# EAGLE design open_cw_keyer_mk2_v30 (EAGLE 9.2.2)
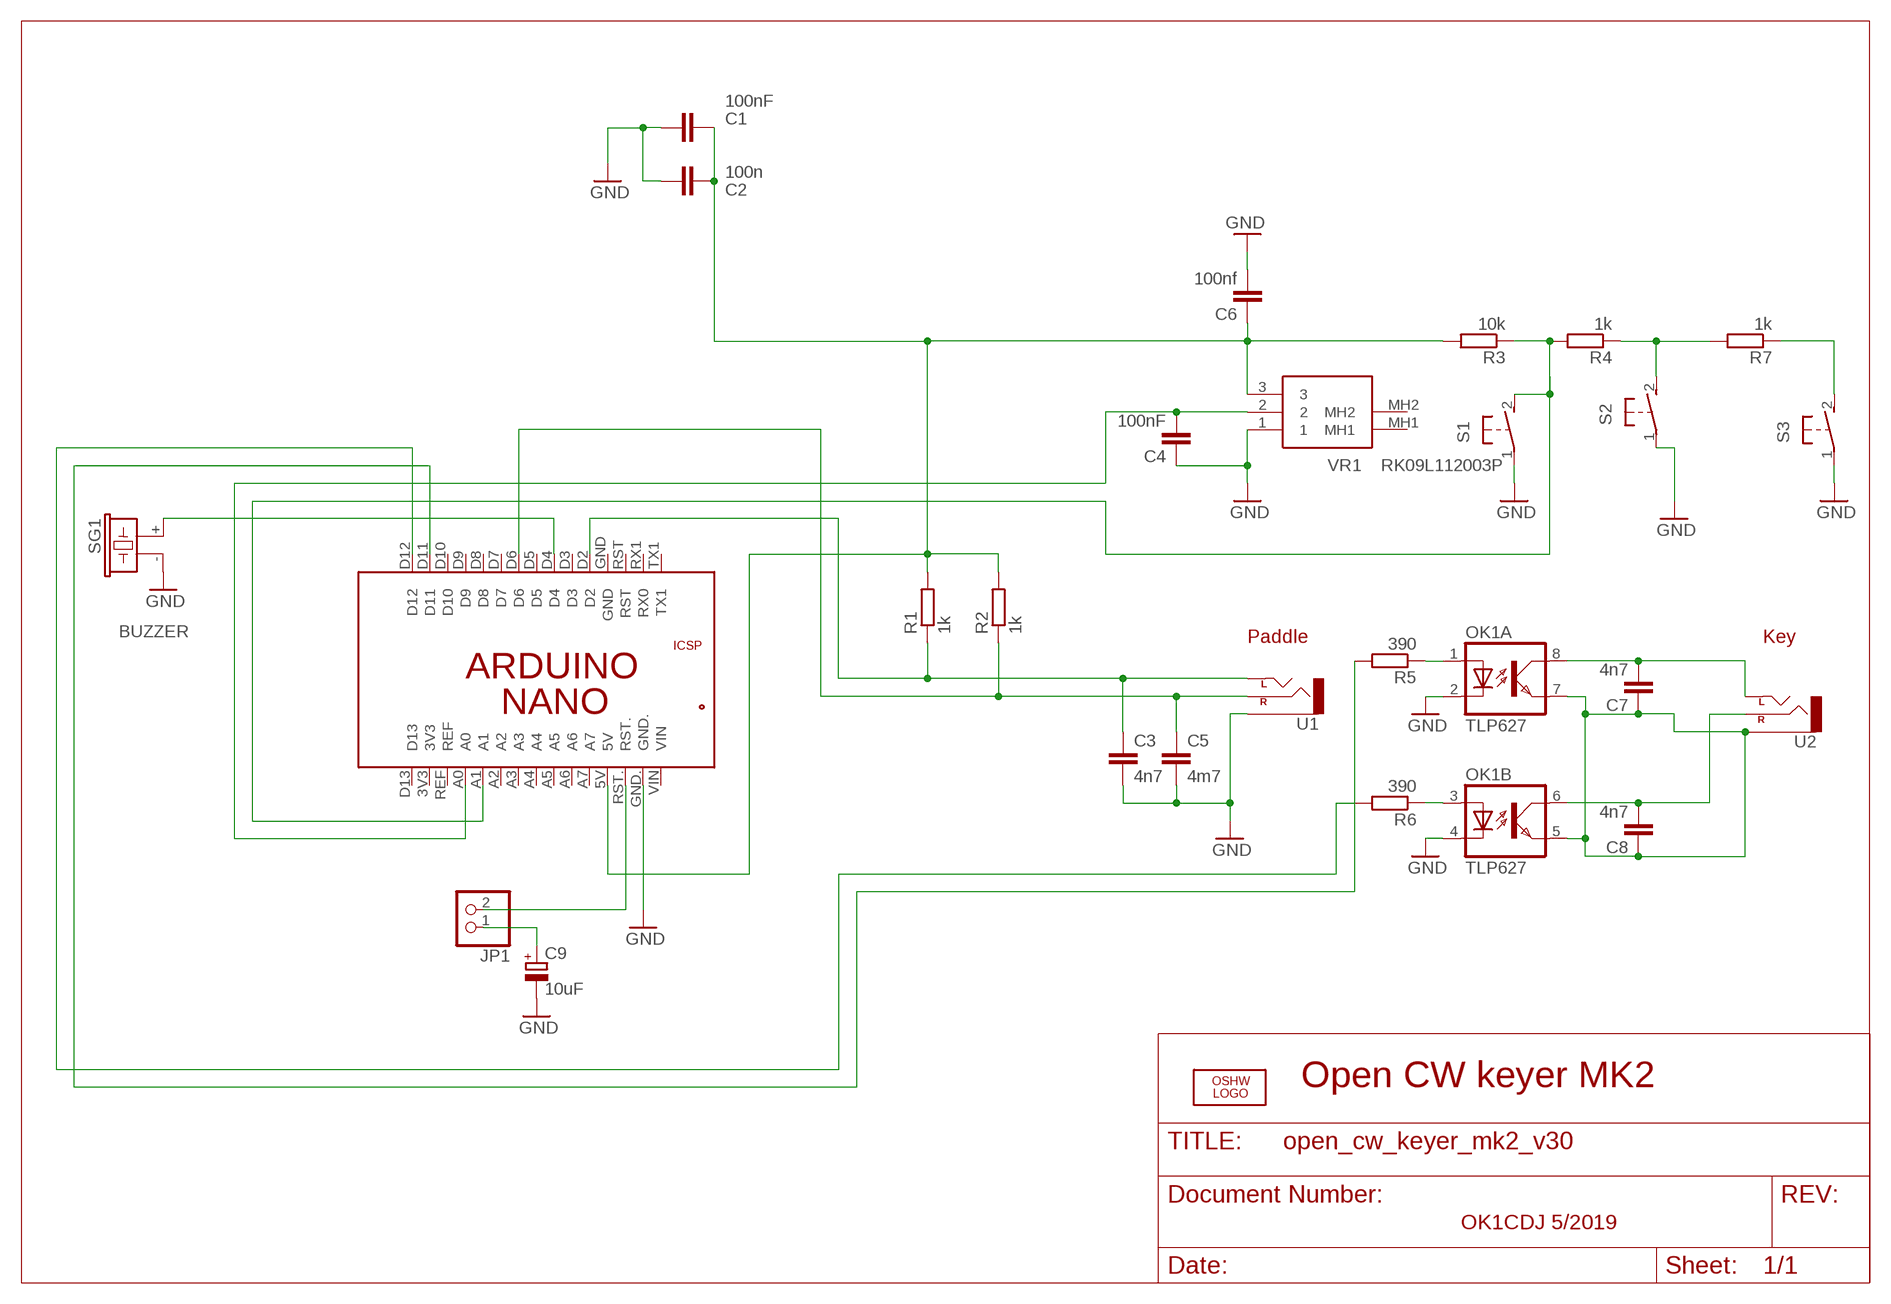
[diagram p0: schematic, sheet 1]

## Parts
C1  100nF  C-EUC0805  [C0805]
C2  100n  C-EUC0805  [C0805]
C3  4n7  C-EUC0805  [C0805]
C4  100nF  C-EUC0805  [C0805]
C5  4m7  C-EUC0805  [C0805]
C6  100nf  C-EUC0805  [C0805]
C7  4n7  C-EUC0805K  [C0805K]
C8  4n7  C-EUC0805K  [C0805K]
C9  10uF  CPOL-EUB/3528-21R  [B/3528-21R]
JP1  PINHD-1X2/90  [1X02/90]
LOGO1  OSHW_LOGO_FILLX0150-NT  [OSHW_FILLX150_NOTEXT]
OK1  TLP627  ILD621  [DIL08]
PCB1  ARDUINO_NANO  [ARDUINO_NANO]
R1  1k  R-EU_M0805  [M0805]
R2  1k  R-EU_M0805  [M0805]
R3  10k  R-EU_M0805  [M0805]
R4  1k  R-EU_M0805  [M0805]
R5  390  R-EU_M0805  [M0805]
R6  390  R-EU_M0805  [M0805]
R7  1k  R-EU_M0805  [M0805]
S1  31-XX  [B3F-31XX]
S2  31-XX  [B3F-31XX]
S3  31-XX  [B3F-31XX]
SG1  BUZZER  F/CM12P  [F/CM12P]
U1  AUDIO-JACKPTH  [AUDIO-JACK]
U2  AUDIO-JACKPTH  [AUDIO-JACK]
VR1  RK09L112003P  [RK09L112003P]

## Nets
5V: C1.1 C2.1 C6.1 PCB1.5V R1.2 R2.2 R3.2 VR1.3
GND: C1.2 C2.2 C3.2 C4.1 C5.2 C6.2 C9.- OK1.2(A:C) OK1.4(B:C) PCB1.GND. S1.1(P) S2.1(P) S3.1(P) SG1.- U1.SLEEVE VR1.1
N$1: C3.1 PCB1.D2 R1.1 U1.TIP(LEFT)
N$2: PCB1.D4 SG1.+
N$3: JP1.2 PCB1.RST.
N$4: R4.1 R7.2 S2.2(S)
N$5: OK1.1(A:A) R5.1
N$6: OK1.3(B:A) R6.1
N$7: C9.+ JP1.1
N$8: C7.2 OK1.8(A:COL) U2.TIP(LEFT)
N$10: C8.2 OK1.6(B:COL) U2.RING(RIGHT)
N$16: R7.1 S3.2(S)
N$21: C7.1 C8.1 OK1.5(B:EMIT) OK1.7(A:EMIT) U2.SLEEVE
N$24: C5.1 PCB1.D6 R2.1 U1.RING(RIGHT)
N$27: PCB1.D11 R5.2
N$40: PCB1.D12 R6.2
POT: C4.2 PCB1.A0 VR1.2
TL: PCB1.A1 R3.1 R4.2 S1.2(S)
Unconnected: PCB1.3V3 PCB1.5V. PCB1.A2 PCB1.A3 PCB1.A4 PCB1.A5 PCB1.A6 PCB1.A7 PCB1.D3 PCB1.D5 PCB1.D7 PCB1.D8 PCB1.D9 PCB1.D10 PCB1.D13 PCB1.GND PCB1.GND_ PCB1.MISO PCB1.MOSI PCB1.REF PCB1.RESET.. PCB1.RST PCB1.RX1(RX0) PCB1.SCK PCB1.TX1 PCB1.VIN VR1.MH1 VR1.MH2

## Notes on the sheet
- Paddle | Key
- Open CW keyer MK2
- OK1CDJ 5/2019

## Library data of the parts
C1-C8 = rcl:C-EU: CAPACITOR, European symbol
C9 = rcl:CPOL-EU: POLARIZED CAPACITOR, European symbol
JP1 = pinhead:PINHD-1X2: PIN HEADER
LOGO1 = ohw-logo:OSHW_LOGO_FILL
OK1 = optocoupler:ILD621: SIEMENS OPTO COUPLER; MF: VISHAY/TELEFUNKEN; MPN: ILD621; OC_FARNELL: 1020151; OC_NEWARK: 58K1678
PCB1 = E14_Arduino_published:ARDUINO_NANO: Device for representing an Arduino Nano board with a footprint in an EAGLE design. Created by Dave Young for Element14. More EAGLE documentation at: http://www.element14.com/community/community/knode/cadsoft_eagle
R1 R2 = rcl:R-EU_: RESISTOR, European symbol
R3-R7 = resistor:R-EU_: RESISTOR, European symbol
S1-S3 = switch-omron:31-XX: OMRON SWITCH; MPN: B3F-3100; OC_FARNELL: 959704; OC_NEWARK: 36M3582
SG1 = buzzer:F/CM12P: BUZZER Source: Buerklin; OC_FARNELL: unknown; OC_NEWARK: unknown
U1 U2 = SparkFun:AUDIO-JACK: 3.5mm Audio Jack Simple 3.5mm common PCB mount audio jack. SKU: PRT-08032
VR1 = RK09L112003P:RK09L112003P: Alps Electric RK09L112003P 1 Gang Rotary Potentiometer with a 6 mm Dia. Shaft, 20k, +/-20%, 0.05W, Linear Source: Datasheet <https://componentsearchengine.com/Datasheets/1/RK09L112003P.pdf>; DESCRIPTION: Alps Electric RK09L112003P 1 Gang Rotary Potentiometer with a 6 mm Dia. Shaft, 20k, +/-20%, 0.05W, Linear; HEIGHT: 11.35mm; MANUFACTURER_NAME: ALPS; MANUFACTURER_PART_NUMBER: RK09L112003P; MOUSER_PART_NUMBER: 688-RK09L112003P; MOUSER_PRICE-STOCK: https://www.mouser.com/Search/Refine.aspx?Keyword=688-RK09L112003P

## Board
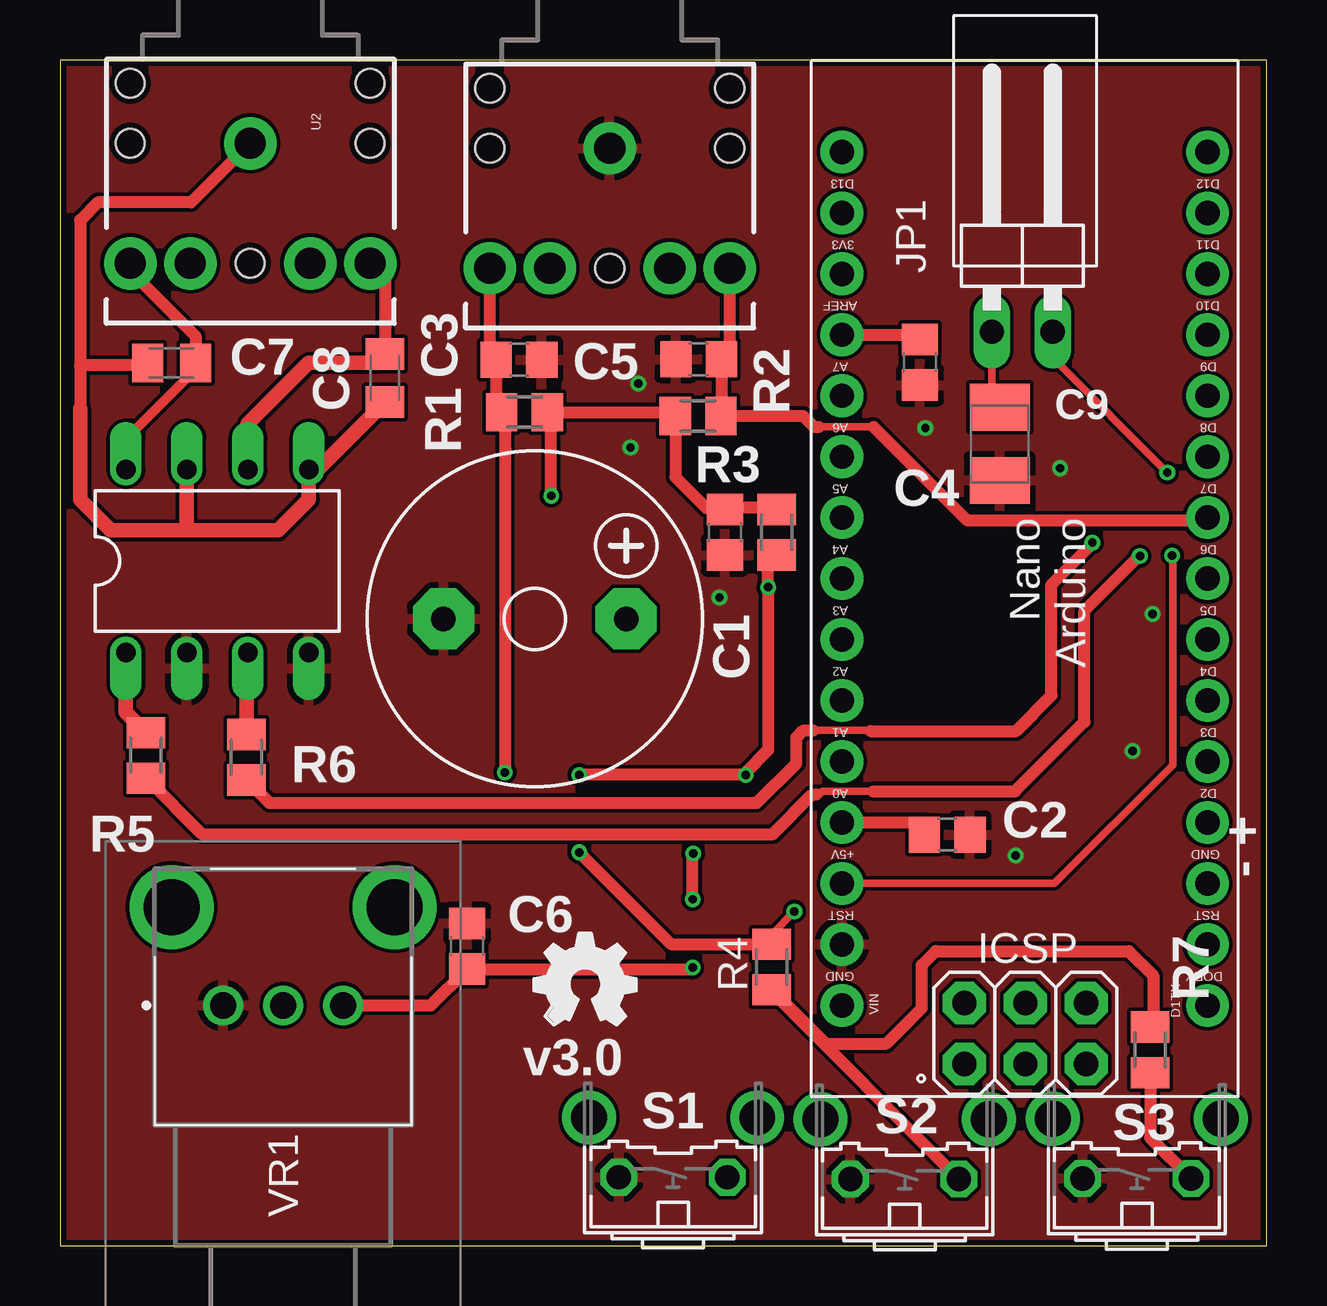
[diagram p1: board, top side]
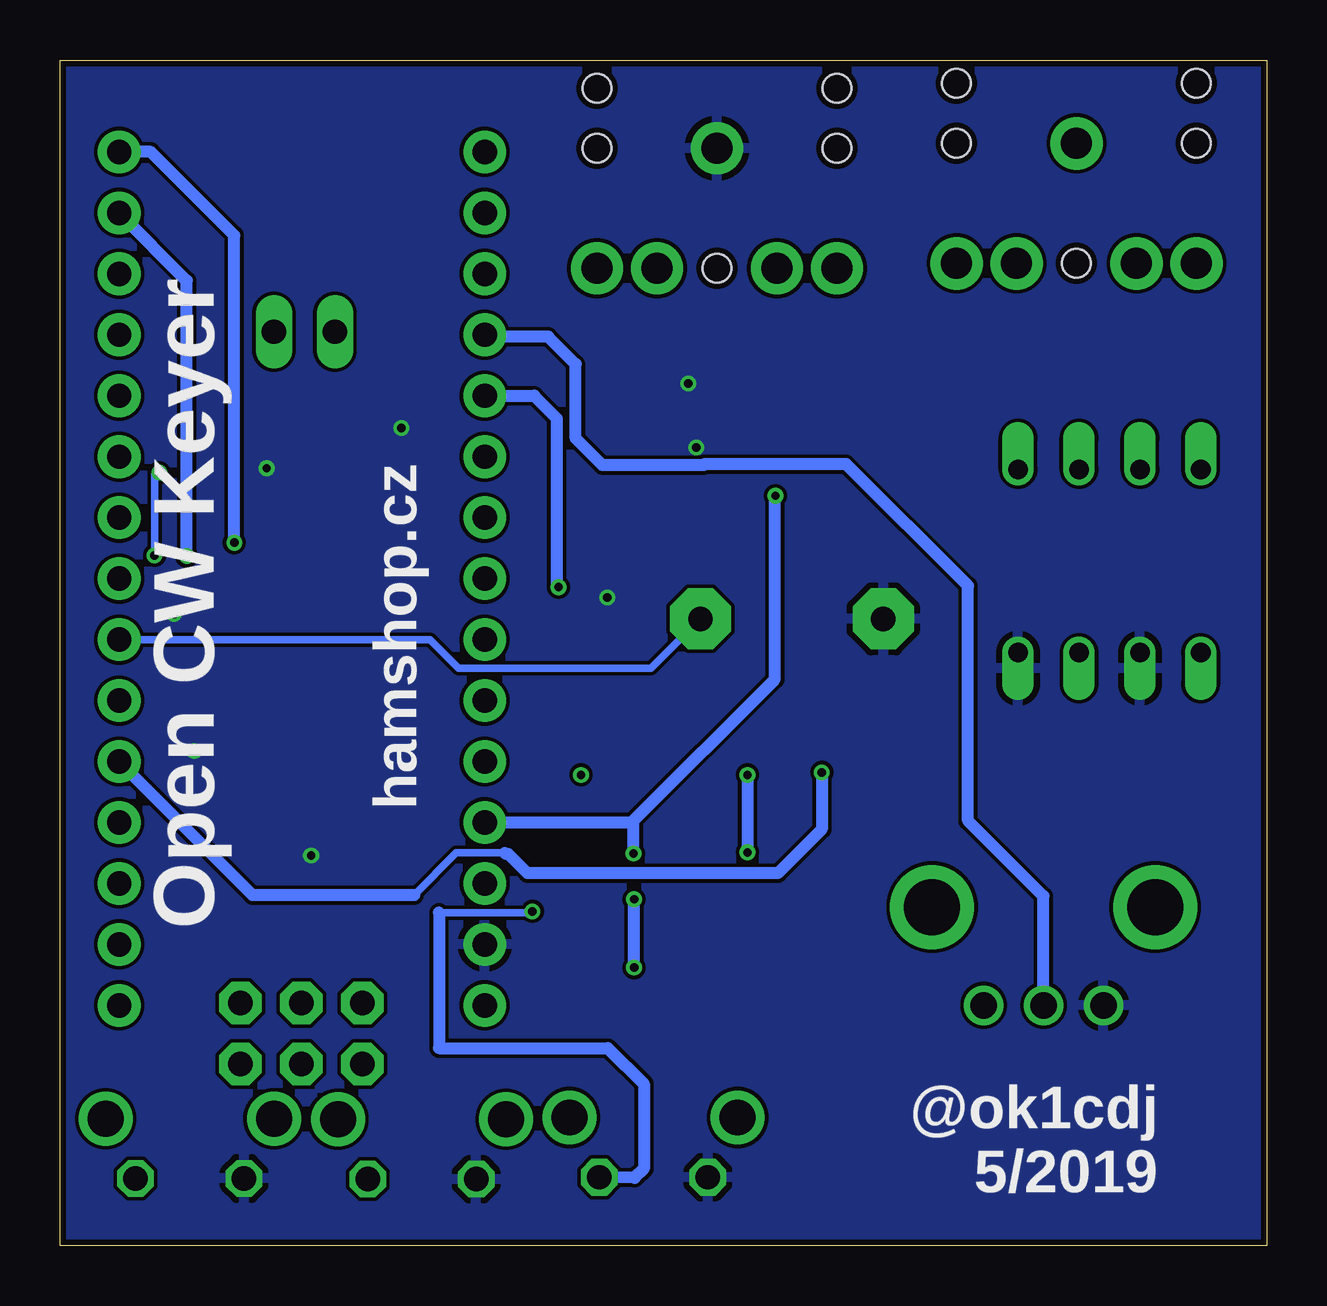
[diagram p2: board, bottom side, seen from below]

Size 50.3 x 49.4 mm. Coordinates in mm from the lower left corner, seen from the top.
Outline: 0,0 50.3,0 50.3,49.4 0,49.4 0,0
Copper layers (1*16): Top 0.035mm / dielectric 1.5mm / Bottom 0.035mm
Design rules "Fusion_eagle_rule_v1.1": minimum track width 6mil, minimum drill 12mil, track to track 6mil, track to pad 6mil, pad to pad 6mil, via to via 6mil, smd to smd 0mil, copper to edge 10mil, drill to drill 10mil, minimum pad ring 10mil, minimum via ring 6mil, stop-mask expansion 2mil, vias tented up to drill 100mil, thermal gap 10mil

### Footprints (pad centres in the part's own frame; a part is rotated, then mirrored left to right if it is on the bottom)
C0805 = smd 1.3 x 1.5: 1 -0.95,0; 2 0.95,0
C0805K = smd 1.3 x 1.6: 1 -1,0; 2 1,0
B/3528-21R = smd 1.95 x 2.5: + 1.525,0; - -1.525,0
1X02/90 = drill 1.016 long: 1 -1.27,-3.81; 2 1.27,-3.81
DIL08 = drill 0.813 offset: 1 -3.81,-3.81; 2 -1.27,-3.81; 3 1.27,-3.81; 4 3.81,-3.81; 5 3.81,3.81; 6 1.27,3.81; 7 -1.27,3.81; 8 -3.81,3.81
ARDUINO_NANO = drill 1.016 pad 1.778: 3V3 6.35,1.27; 5V 31.75,1.27; A0 11.43,1.27; A1 13.97,1.27; A2 16.51,1.27; A3 19.05,1.27; A4 21.59,1.27; A5 24.13,1.27; A6 26.67,1.27; A7 29.21,1.27; D2 29.21,16.51; D3 26.67,16.51; D4 24.13,16.51; D5 21.59,16.51; D6 19.05,16.51; D7 16.51,16.51; D8 13.97,16.51; D9 11.43,16.51; D10 8.89,16.51; D11 6.35,16.51; D12 3.81,16.51; D13 3.81,1.27; GND 31.75,16.51; GND. 36.83,1.27; REF 8.89,1.27; RST 34.29,16.51; RST. 34.29,1.27; RX1 36.83,16.51; TX1 39.37,16.51; VIN 39.37,1.27 | drill 1.016 pad 1.778 octagon: 5V. 39.268,6.375; GND_ 39.268,11.455; MISO 41.808,6.375; MOSI 39.268,8.915; RESET.. 41.808,11.455; SCK 41.808,8.915
M0805 = smd 1.3 x 1.6: 1 -0.95,0; 2 0.95,0
B3F-31XX = drill 1.016 octagon: 1 -2.261,-1.245; 2 2.261,-1.245 | drill 1.499 pad 2.159: 3 -3.505,1.245; 4 3.505,1.245
F/CM12P = drill 1.016 pad 2.54 octagon: + 3.81,0; - -3.81,0
AUDIO-JACK = drill 1.3 pad 2.184: RING 5,5; RSH 5,2.5; SLEEVE 0,0; TIP 5,-5; TSH 5,-2.5 | hole 1.2: 0,5; -2.5,5; -2.5,-5; 0,-5; 5,0
RK09L112003P = drill 1.1 pad 1.65: 1 -5,-2.5; 2 -5,0; 3 -5,2.5 | drill 2.332 pad 3.499: MH1 -9.1,4.65; MH2 -9.1,-4.65

### Placement (x,y rotation side)
C1  27.72,29.72 270 top
C2  36.99,17.12 0 top
C3  19.13,36.91 0 top
C4  35.84,36.81 90 top
C5  26.62,36.93 180 top
C6  16.97,12.47 90 top
C7  4.65,36.78 0 top
C8  13.54,36.15 90 top
C9  39.17,33.4 90 top
JP1  40.11,41.89 0 top
LOGO1  19.77,9.2 0 top
OK1  6.56,28.53 0 top
PCB1  31.32,49.38 270 top
R1  19.36,34.72 0 top
R2  26.6,34.57 180 top
R3  29.88,29.72 90 top
R4  29.67,11.61 90 top
R5  3.59,20.42 270 top
R6  7.78,20.35 270 top
R7  45.45,8.16 90 top
S1  25.56,4.09 0 top
S2  35.21,4.02 0 top
S3  44.89,4.04 0 top
SG1  19.79,26.11 0 top
U1  22.92,45.72 270 top
U2  7.93,45.93 270 top
VR1  9.3,5.01 270 top

### Tracks (layer width: path | path; a pad name or v marks a point on that pad's centre or on a via)
5V  (via drill 0.35)
  Top 0.508: R1.2 20.58,34.72 | 20.58,34.72 25.5,34.72 R2.2 25.65,32.02 26.93,30.74 27.65,30.74 | v20.48,31.25 20.48,34.62 20.58,34.72 | R3.2 29.81,30.74 27.65,30.74 | VR1.3 15.45,10.01 C6.1 26.41,11.53 26.42,11.54 v26.37,11.59 | v26.37,14.43 26.37,16.31 v26.39,16.34 | 27.65,30.74 C1.1 | PCB1.5V 36.04,17.63 C2.1
  Bottom 0.508: PCB1.5V 26.47,17.63 | 26.47,17.63 20.5,23.6 20.5,31.25 v20.48,31.25 | v26.39,16.34 26.39,17.55 26.47,17.63 | v26.37,11.59 v26.37,14.43
GND  (via drill 0.35)
  other vias: 24.11,35.92 23.78,33.25 27.49,27 39.83,16.26 45.55,26.32 44.71,20.6 36.07,34.06 41.69,32.39
  pour Top: -0.02,-0.4 50.2,-0.4 50.2,49.41 -0.02,49.41
  pour Bottom: -0.02,49.3 50.2,49.3 50.2,-0.4 -0.02,-0.4
N$1  (via drill 0.35)
  Top 0.508: U1.TIP 17.92,37.17 C3.1 18.18,34.95 R1.1 18.55,34.59 18.55,19.79 18.57,19.76 18.55,19.74 v18.55,19.71
  Bottom 0.305: 31.75,16.36 33.79,16.36 35.54,14.61
  Bottom 0.508: v18.55,19.71 18.55,17.35 20.38,15.52 30.81,15.52 31.6,16.31 31.7,16.31 31.75,16.36 | PCB1.D2 42.27,14.61 35.54,14.61
N$2
  Bottom 0.305: PCB1.D4 34.88,25.25 33.69,24.06 25.66,24.06 SG1.+
N$3  (via drill 0.35)
  Top 0.305: PCB1.RST. 41.46,15.09 46.39,20.02 46.39,28.73 v46.36,28.76 | v46.16,32.21 41.38,36.99 JP1.2
  Bottom 0.305: v46.36,28.76 46.36,32.11 46.23,32.24 46.18,32.24 v46.16,32.21
N$4
  Top 0.508: S2.2 29.59,10.65 R4.1 31.92,8.41 34.45,8.41 35.92,9.88 35.92,11.69 36.51,12.27 44.56,12.27 45.57,11.26 45.57,9.23 R7.2
N$5
  Top 0.61: OK1.1 2.75,22.21 R5.1
N$6
  Top 0.61: OK1.3 7.78,24.67 R6.1
N$7
  Top 0.305: C9.+ 38.84,35.26 JP1.1
N$8
  Top 0.406: C7.2 5.65,36.51 2.75,33.61 OK1.8
  Top 0.508: U2.TIP 2.93,40.61 5.65,37.89 5.65,36.51
N$10
  Top 0.508: U2.RING 13.54,40.31 C8.2
  Top 0.61: OK1.6 7.83,34.24 10.37,36.78 13.18,36.78 C8.2
N$16
  Top 0.508: R7.1 45.45,4.5 S3.2
N$21
  Top 0.508: U2.SLEEVE 5.47,43.46 1.58,43.46 0.84,42.73 0.84,36.68 | 0.84,36.68 0.84,34.88 | C7.1 3.55,36.68 0.84,36.68
  Top 0.61: 5.29,29.8 2.11,29.8 0.84,31.07 0.84,34.88 | 5.29,29.8 9.1,29.8 10.37,31.07 OK1.5 10.73,32.34 C8.1 | 5.29,29.8 OK1.7
N$24
  Top 0.305: 31.63,34.11 33.91,34.11
  Top 0.508: U1.RING 27.92,37.28 C5.1 27.57,34.6 R2.1 30.97,34.57 31.43,34.11 31.63,34.11 | 33.91,34.11 37.83,30.2 47.71,30.2 PCB1.D6
  Top 0.61: 27.81,37.17 C5.1 27.64,37
N$27  (via drill 0.35)
  Top 0.305: 31.53,18.8 31.65,18.8 31.78,18.93 33.89,18.93
  Top 0.508: R5.2 5.91,17.15 29.72,17.15 31.37,18.8 31.53,18.8 | 33.89,18.93 39.81,18.93 42.7,21.82 42.7,26.45 44.91,28.65 44.94,28.65 v45.01,28.73
  Bottom 0.508: v45.01,28.73 45.01,40.21 PCB1.D11
N$40  (via drill 0.35)
  Top 0.305: 31.4,21.47 33.76,21.47 33.79,21.44
  Top 0.508: R6.2 8.73,18.44 29.04,18.44 30.69,20.1 30.69,21.16 30.99,21.47 31.4,21.47 | 33.79,21.44 39.86,21.44 41.33,22.91 41.33,27.49 41.3,27.51 43.08,29.29 43.08,29.32 43.06,29.32 v43.03,29.29
  Bottom 0.508: v43.03,29.29 43.03,42.09 46.51,45.57 PCB1.D12
POT
  Top 0.508: PCB1.A0 35.65,37.95 C4.2
  Bottom 0.508: VR1.2 9.3,14.56 12.45,17.71 12.45,27.49 17.53,32.57 18.34,32.57 23.43,32.57 23.47,32.52 27.69,32.52 28.81,33.63 28.81,36.73 29.95,37.88 32.52,37.88 PCB1.A0
TL  (via drill 0.35)
  Top 0.305: v30.61,13.92 29.67,12.98 R4.2
  Top 0.508: R3.1 29.52,28.42 v29.52,27.44 29.52,20.65 28.55,19.69 28.58,19.66 v28.58,19.61 v21.65,19.61 | v21.65,16.39 25.47,12.56 R4.2
  Top 0.61: R3.1 29.82,28.72
  Bottom 0.305: 34.5,13.87 30.81,13.87 30.74,13.79 v30.61,13.92
  Bottom 0.508: PCB1.A1 30.54,35.41 29.6,34.47 29.6,27.46 29.57,27.44 v29.52,27.44 | v21.65,19.61 v21.65,16.39 | 34.5,13.87 34.5,8.23 27.46,8.23 25.96,6.73 25.96,3.2 26.34,2.82 28.22,2.85 S1.2

### Text on the board
tNames: - + | v3.0
bNames: hamshop.cz | Open CW Keyer | @ok1cdj / 5/2019